# Altium schematic sheet eBox_3G_SIM.schdoc: car_logger_fona_sim
size A4; DocumentNumber: 2; SheetNumber: 2; SheetTotal: 3
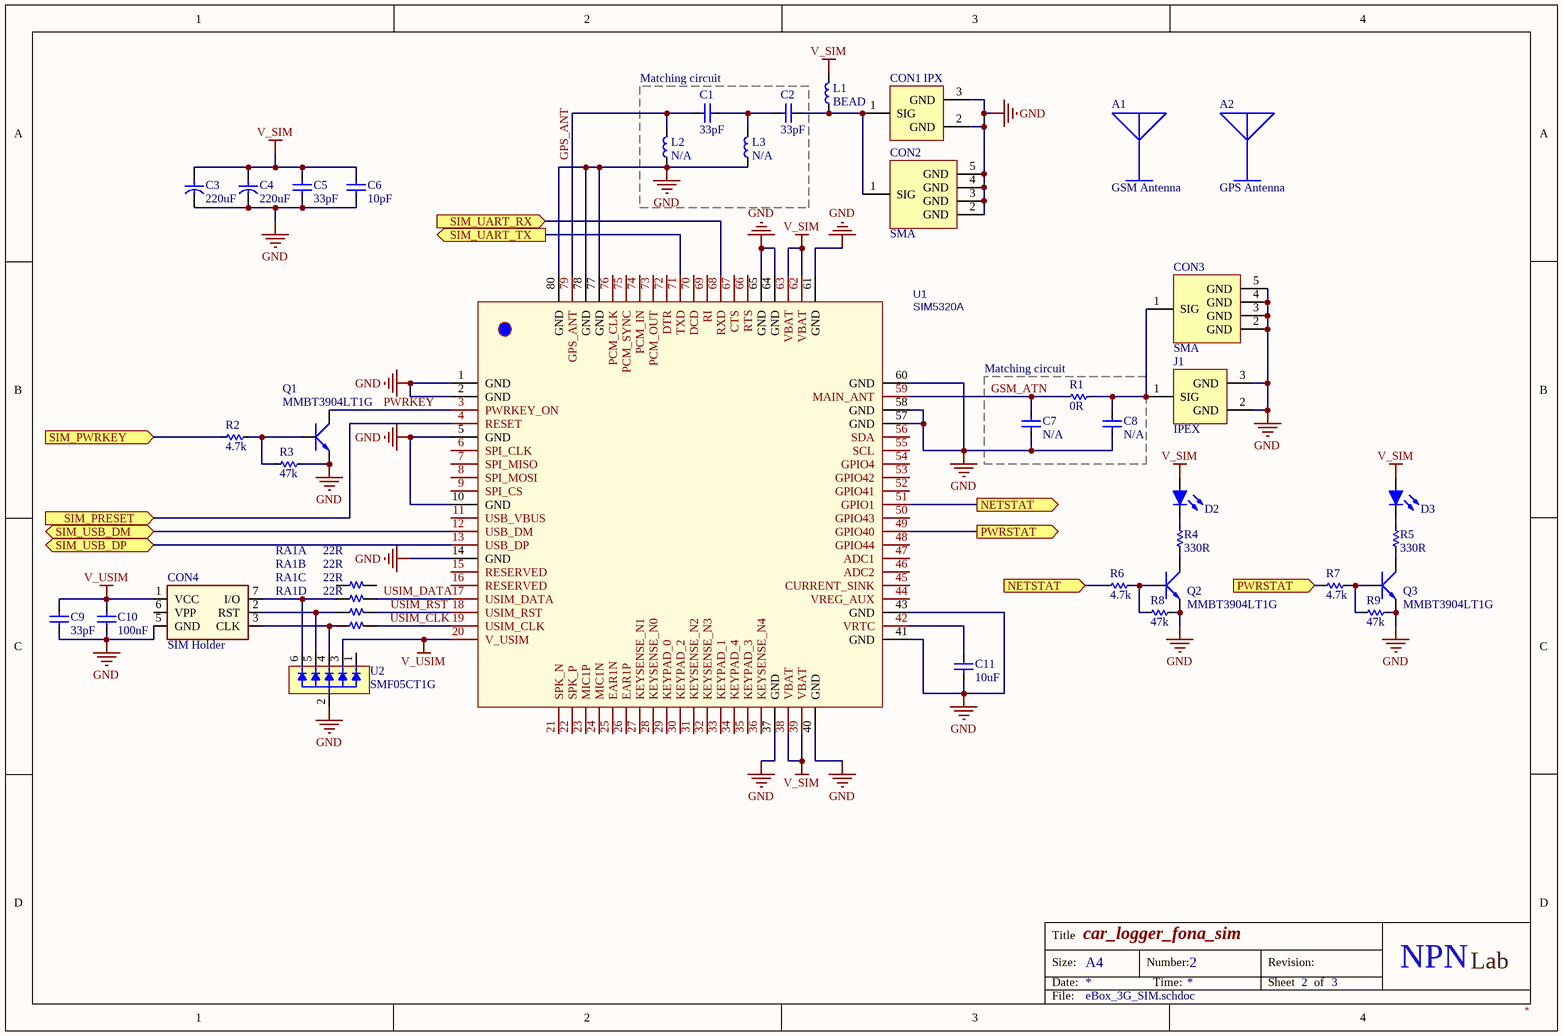
[diagram p0: eBox_3G_SIM.schdoc]

## Parts
A1  GSM Antenna  [Antenna]
A2  GPS Antenna  [Antenna]
C1  33pF  [CC 0603]
C2  33pF  [CC 0603]
C3  220uF  [C SMD ALU (D8)]
C4  220uF  [C SMD ALU (D8)]
C5  33pF  [CC 0603]
C6  10pF  [CC 0603]
C7  N/A  [CC 0603]
C8  N/A  [CC 0603]
C9  33pF  [CC 0603]
C10  100nF  [CC 0603]
C11  10uF  [CC 0805]
CON1  IPX  [CONN/IPX/SMD]
CON2  SMA  [CONN/SMA/RA]
CON3  SMA  [CONN/SMA/RA]
CON4  SIM Holder  [CON SIM Holder C707]
D2  LED GREEN  [Led 0603 - green]  (value not drawn)
D3  LED RED  [Led 0603 - red]  (value not drawn)
J1  IPEX  [CONN/IPX/SMD]
L1  BEAD  [LL 0603]
L2  N/A  [LL 0603]
L3  N/A  [LL 0603]
Q1  MMBT3904LT1G  [SOT-23]
Q2  MMBT3904LT1G  [SOT-23]
Q3  MMBT3904LT1G  [SOT-23]
R1  0R  [RR 0603]
R2  4.7k  [RR 0603]
R3  47k  [RR 0603]
R4  330R  [RR 0603]
R5  330R  [RR 0603]
R6  4.7k  [RR 0603]
R7  4.7k  [RR 0603]
R8  47k  [RR 0603]
R9  47k  [RR 0603]
RA1  22R  [RAx4 1206 (3216)]  (parts A,B,C,D of 4)
U1  SIM5320A  [SIM5320]
U2  SMF05CT1G  [SOT-363-6]

## Blocks framed on the sheet
Matching circuit: C1 C2 L2 L3
Matching circuit: C7 C8 R1

## Ports
NETSTAT (in), NETSTAT (out), PWRSTAT (in), PWRSTAT (out), SIM_PRESET (in), SIM_PWRKEY (in), SIM_UART_RX (in), SIM_UART_TX (out), SIM_USB_DM, SIM_USB_DP

## Nets
GND: C3.2 C4.2 C5.1 C6.1 C7.1 C8.1 C9.2 C10.2 C11.1 CON1.2(GND) CON1.3(GND) CON2.2(GND) CON2.3(GND) CON2.4(GND) CON2.5(GND) CON3.2(GND) CON3.3(GND) CON3.4(GND) CON3.5(GND) CON4.5(GND) J1.2(GND) J1.3(GND) L2.1 L3.1 Q1.2(E) Q2.2(E) Q3.2(E) R3.2 R8.2 R9.2 U1.1(GND) U1.2(GND) U1.5(GND) U1.10(GND) U1.14(GND) U1.37(GND) U1.40(GND) U1.41(GND) U1.43(GND) U1.57(GND) U1.58(GND) U1.60(GND) U1.61(GND) U1.64(GND) U1.65(GND) U1.77(GND) U1.78(GND) U1.80(GND) U2.2(A)
V_SIM: C3.1 C4.1 C5.2 C6.2 D2.1(A) D3.1(A) L1.2 U1.38(VBAT) U1.39(VBAT) U1.62(VBAT) U1.63(VBAT)
V_USIM: C9.1 C10.1 CON4.1(VCC) U1.20(V_USIM) U2.3(K3)
GPS_ANT: C1.2 L2.2 U1.79(GPS_ANT)
GSM_ATN: C7.2 R1.2 U1.59(MAIN_ANT)
NETSTAT: R6.1 U1.51(GPIO1) ; port NETSTAT
PWRKEY: Q1.3(C) U1.3(PWRKEY_ON)
PWRSTAT: R7.1 U1.49(GPIO40) ; port PWRSTAT
SIM_PRESET: U1.4(RESET) ; port SIM_PRESET
SIM_PWRKEY: R2.1 ; port SIM_PWRKEY
SIM_UART_RX: U1.68(RXD) ; port SIM_UART_RX
SIM_UART_TX: U1.71(TXD) ; port SIM_UART_TX
SIM_USB_DM: U1.12(USB_DM) ; port SIM_USB_DM
SIM_USB_DP: U1.13(USB_DP) ; port SIM_USB_DP
USIM_CLK: RA1.5 U1.19(USIM_CLK)
USIM_DATA: RA1.7 U1.17(USIM_DATA)
USIM_RST: RA1.6 U1.18(USIM_RST)
NetC1_1: C1.1 C2.2 L3.2
NetC2_1: C2.1 CON1.1(SIG) CON2.1(SIG) L1.1
NetC8_2: C8.2 CON3.1(SIG) J1.1(SIG) R1.1
NetC11_2: C11.2 U1.42(VRTC)
NetCON4_2: CON4.2(RST) RA1.3 U2.5(K5)
NetCON4_3: CON4.3(CLK) RA1.4 U2.4(K4)
NetCON4_7: CON4.7(I/O) RA1.2 U2.6(K6)
NetD2_2: D2.2(K) R4.2
NetD3_2: D3.2(K) R5.2
NetQ1_1: Q1.1(B) R2.2 R3.1
NetQ2_1: Q2.1(B) R6.2 R8.1
NetQ2_3: Q2.3(C) R4.1
NetQ3_1: Q3.1(B) R7.2 R9.1
NetQ3_3: Q3.3(C) R5.1

Not connected (* = marked no-connect by the designer): CON4 6(VPP); RA1 1 8; U1 6(SPI_CLK) 7(SPI_MISO) 8(SPI_MOSI) 9(SPI_CS) 11(USB_VBUS) 15(RESERVED) 16(RESERVED) 21(SPK_N) 22(SPK_P) 23(MIC1P) 24(MIC1N) 25(EAR1N) 26(EAR1P) 27(KEYSENSE_N1) 28(KEYSENSE_N0) 29(KEYPAD_0) 30(KEYPAD_2) 31(KEYSENSE_N2) 32(KEYSENSE_N3) 33(KEYPAD_1) 34(KEYPAD_4) 35(KEYPAD_3) 36(KEYSENSE_N4) 44(VREG_AUX) 45(CURRENT_SINK) 46(ADC2) 47(ADC1) 48(GPIO44) 50(GPIO43) 52(GPIO41) 53(GPIO42) 54(GPIO4) 55(SCL) 56(SDA) 66(RTS) 67(CTS) 69(RI) 70(DCD) 72(DTR) 73(PCM_OUT) 74(PCM_IN) 75(PCM_SYNC) 76(PCM_CLK); U2 1(K1)

## Notes on the sheet
- Title
- Size:
- Date:
- A4
- Number:
- Time:
- Revision:
- Sheet
- of
- NPN
- Lab
- File:

## Library data of the parts
A1 A2 = Antenna
C1 C2 C5 C9 = Capacitor NP: CAP CER 33PF 100V C0G/NP0 0603; Manufacturer: Murata Electronics; Manufacturer Part Number: GCM1885C2A330JA16D; Supplier 1: Digi-Key; Supplier Part Number 1: 490-4943-2-ND; Termination Style: SMD/SMT; Package: 0603 (1608 Metric)
C3 C4 = Capacitor: CAP TANT POLY 100UF 6.3V 1210; Manufacturer: AVX Corporation; Manufacturer Part Number: TCJB107M006R0055; Package: 1210 (3528 Metric); Supplier 1: Digi-Key; Supplier Part Number 1: 478-9410-2-ND; Termination Style: SMD/SMT
C6 = Capacitor NP: CAP CER 10PF 100V C0G/NP0 0603; Manufacturer: Murata Electronics; Manufacturer Part Number: GCM1885C2A100JA16D; Supplier 1: Digi-Key; Supplier Part Number 1: 490-4770-2-ND; Termination Style: SMD/SMT; Package: 0603 (1608 Metric)
C7 C8 = Capacitor NP: CAP N/A; Supplier 1: Digi-Key; Termination Style: SMD/SMT; Package: 0603 (1608 Metric)
C10 = Capacitor NP: CAP CER 0.1UF 16V X7R 0603; Manufacturer: Murata Electronics; Manufacturer Part Number: GCJ188R71C104KA01D; Supplier 1: Digi-Key; Supplier Part Number 1: 490-5796-2-ND; Termination Style: SMD/SMT; Package: 0603 (1608 Metric)
C11 = Capacitor NP: CAP CER 10UF 10V X5R 0603; Manufacturer: Murata Electronics; Manufacturer Part Number: GRM188R61A106KE69D; Supplier 1: Digi-Key; Supplier Part Number 1: 490-10474-2-ND; Termination Style: SMD/SMT; Package: 0603 (1608 Metric)
CON1 = CON IPX
CON2 CON3 = CON SMA: SMA connectors
CON4 = SIM holder 6 pin: SIM Card holder, 6 pins
D2 = Led: LED GREEN DIFFUSED 0603 SMD; Manufacturer: Rohm Semiconductor; Manufacturer Part Number: SML-D12P8WT86; Package: 0603 (1608 Metric); Supplier 1: Digi-Key; Supplier Part Number 1: 511-1579-2-ND; Termination Style: SMD/SMT
D3 = Led: LED RED DIFFUSED 0603 SMD; Manufacturer: Rohm Semiconductor; Manufacturer Part Number: SML-D12U8WT86; Package: 0603 (1608 Metric); Supplier 1: Digi-Key; Supplier Part Number 1: 511-1580-2-ND; Termination Style: SMD/SMT
J1 = CON IPX: CONN UMC RCPT STR 50 OHM SMD; Manufacturer: Taoglas Limited; Manufacturer Part Number: RECE.20279.001E.01; Supplier 1: Digi-Key; Supplier Part Number 1: 931-1107-1-ND; Termination Style: SMD/SMT
L1 = Inductor: FERRITE BEAD 30 OHM 0603 1LN; Manufacturer: Vishay Dale; Manufacturer Part Number: ILBB0603ER300V; Supplier 1: Digi-Key; Supplier Part Number 1: 541-2604-1-ND; Termination Style: SMD/SMT; Package: 0603 (1608 Metric)
L2 L3 = Inductor: IND N/A; Supplier 1: Digi-Key; Termination Style: SMD/SMT; Package: 0603 (1608 Metric)
Q1-Q3 = MMBT3904LT1G: TRANS NPN 40V 0.2A SOT23; Manufacturer: ON Semiconductor; Supplier 1: Digi-Key; Supplier Part Number 1: MMBT3904LT1GOSCT-ND; Manufacturer Part Number: MMBT3904LT1G; Package: SOT-23-3 (TO-236); Termination Style: SMD/SMT
R1 = Resistors: RES SMD 0 OHM JUMPER 1/10W 0603; Manufacturer: Panasonic Industrial Devices; Manufacturer Part Number: ERJ-3GEY0R00V; Supplier 1: Digi-Key; Supplier Part Number 1: P0.0GTR-ND; Termination Style: SMD/SMT; Package: 0603 (1608 Metric)
R2 R6 R7 = Resistors: RES SMD 4.7K OHM 1% 1/10W 0603; Manufacturer: Panasonic Industrial Devices; Manufacturer Part Number: ERJ-3EKF4701V; Supplier 1: Digi-Key; Supplier Part Number 1: P4.70KHTR-ND; Termination Style: SMD/SMT; Package: 0603 (1608 Metric)
R3 R8 R9 = Resistors: RES SMD 47K OHM 5% 1/10W 0603; Manufacturer: Panasonic Industrial Devices; Manufacturer Part Number: ERJ-3GEYJ473V; Supplier 1: Digi-Key; Supplier Part Number 1: P47KGTR-ND; Termination Style: SMD/SMT; Package: 0603 (1608 Metric)
R4 R5 = Resistors: RES SMD 330 OHM 5% 1/10W 0603; Manufacturer: Panasonic Industrial Devices; Manufacturer Part Number: ERJ-3GEYJ331V; Supplier 1: Digi-Key; Supplier Part Number 1: P330GTR-ND; Termination Style: SMD/SMT; Package: 0603 (1608 Metric)
RA1 = Resistor Array x4
U2 = SMF05C: TVS DIODE 5V 12.5V SC88; Manufacturer: ON Semiconductor; Manufacturer Part Number: SMF05CT1G; Package: 6-TSSOP, SC-88, SOT-363; Supplier 1: Digi-Key; Supplier Part Number 1: SMF05CT1GOSCT-ND; Termination Style: SMD/SMT
U1 = SIM5320A: Termination Style: SMD/SMT